# Altium schematic sheet Sheet6.SchDoc: =GlobalProjectName
size 209 x 297 mm; ApprovedBy: Утвердил; CheckedBy: Проверил; Author: Разработал; SheetNumber: 55; SheetTotal: 66; PageSetup: Record=PageOptions|CenterHorizontal=True|CenterVertical=True|PrintScale=1.00|XCorrection=1.00|YCorrection=1.00|PrintKind=1|BorderSize=5000000|LeftOffset=0|BottomOffset=0|Orientation=2|PaperLength=1000|PaperWidth=1000|Scale=100|PaperSource=15|PrintQuality=1200|MediaType=1|DitherType=10|PaperKind=A3|PrintScaleMode=1; Weight: -; ScaleFactor: -; NormInspection: Норм.Контр.
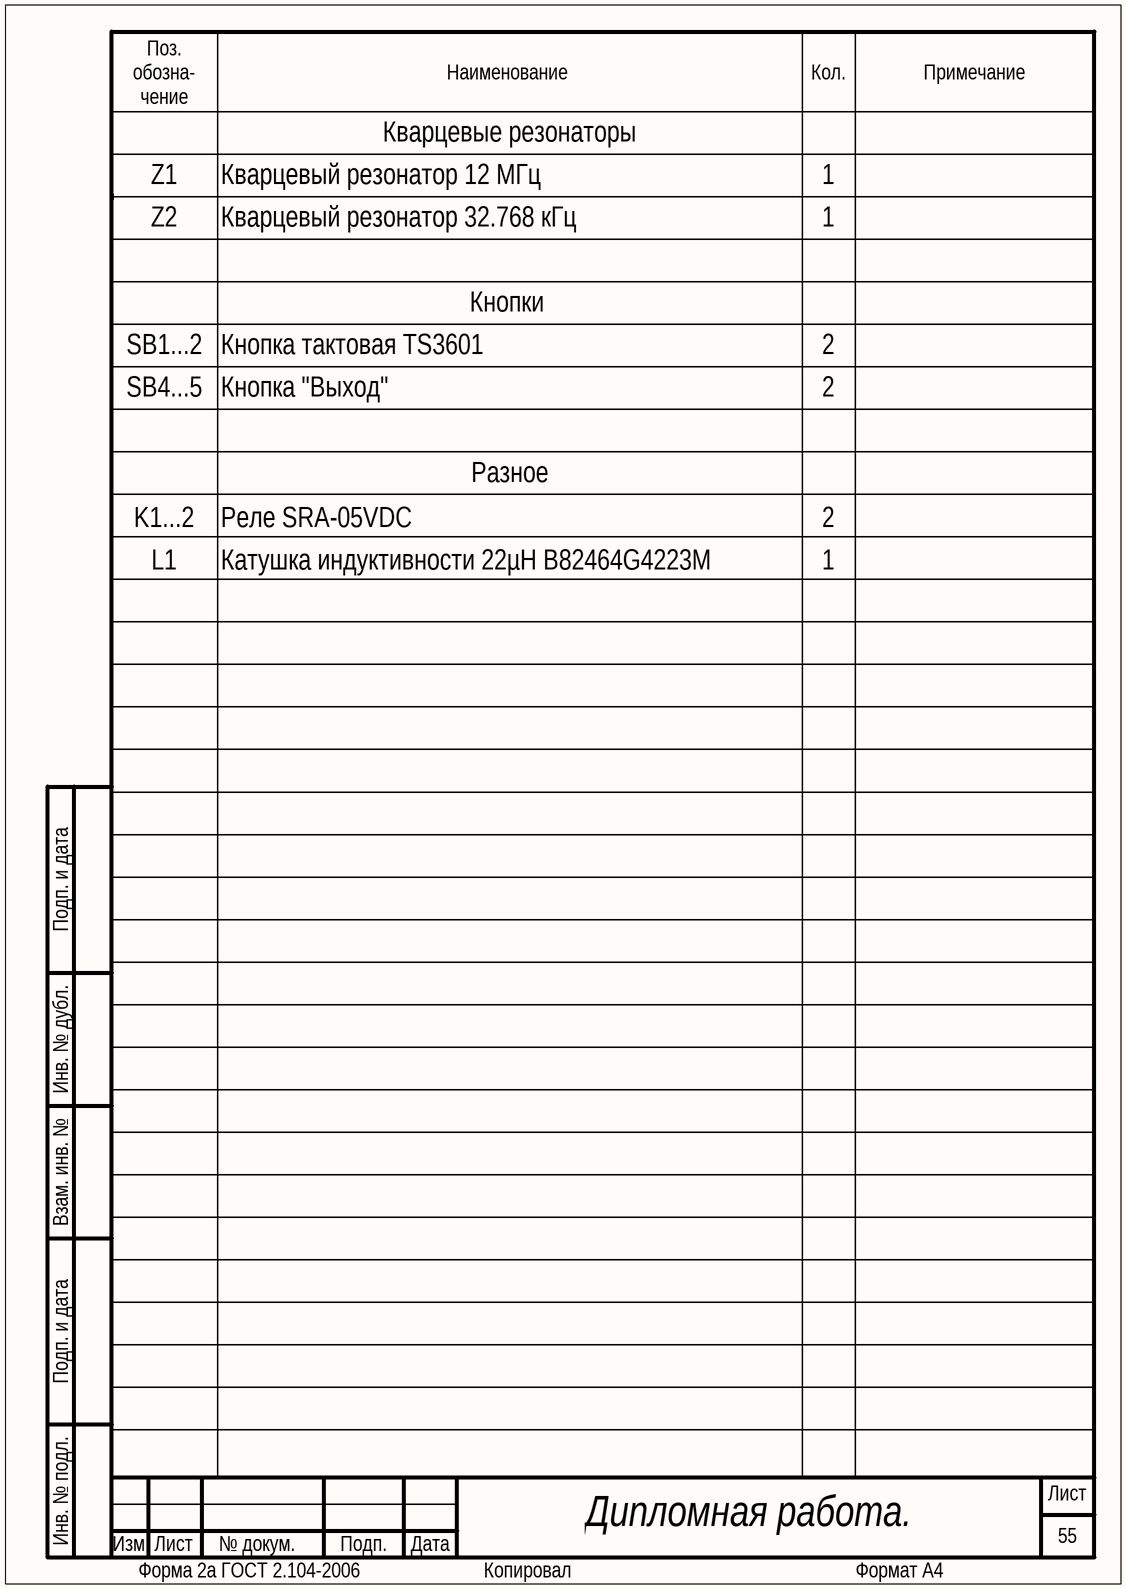
[diagram p0: Sheet6.SchDoc]

## Notes on the sheet
- Z1
- Кварцевые резонаторы
- Кварцевый резонатор 12 МГц
- 1
- Z2
- Кварцевый резонатор 32.768 кГц
- Кнопки
- SB1...2
- Кнопка тактовая TS3601
- 2
- SB4...5
- Кнопка "Выход"
- K1...2
- Разное
- Реле SRA-05VDC
- L1
- Катушка индуктивности 22µH B82464G4223M
- Дипломная работа.
- Поз.
  обозна-
  чение
- Наименование
- Кол.
- Примечание
- Подп. и дата
- Инв. № дубл.
- Взам. инв. №
- Инв. № подл.
- Изм.
- Лист
- № докум.
- Подп.
- Дата
- Форма 2а ГОСТ 2.104-2006
- Копировал
- Формат А4